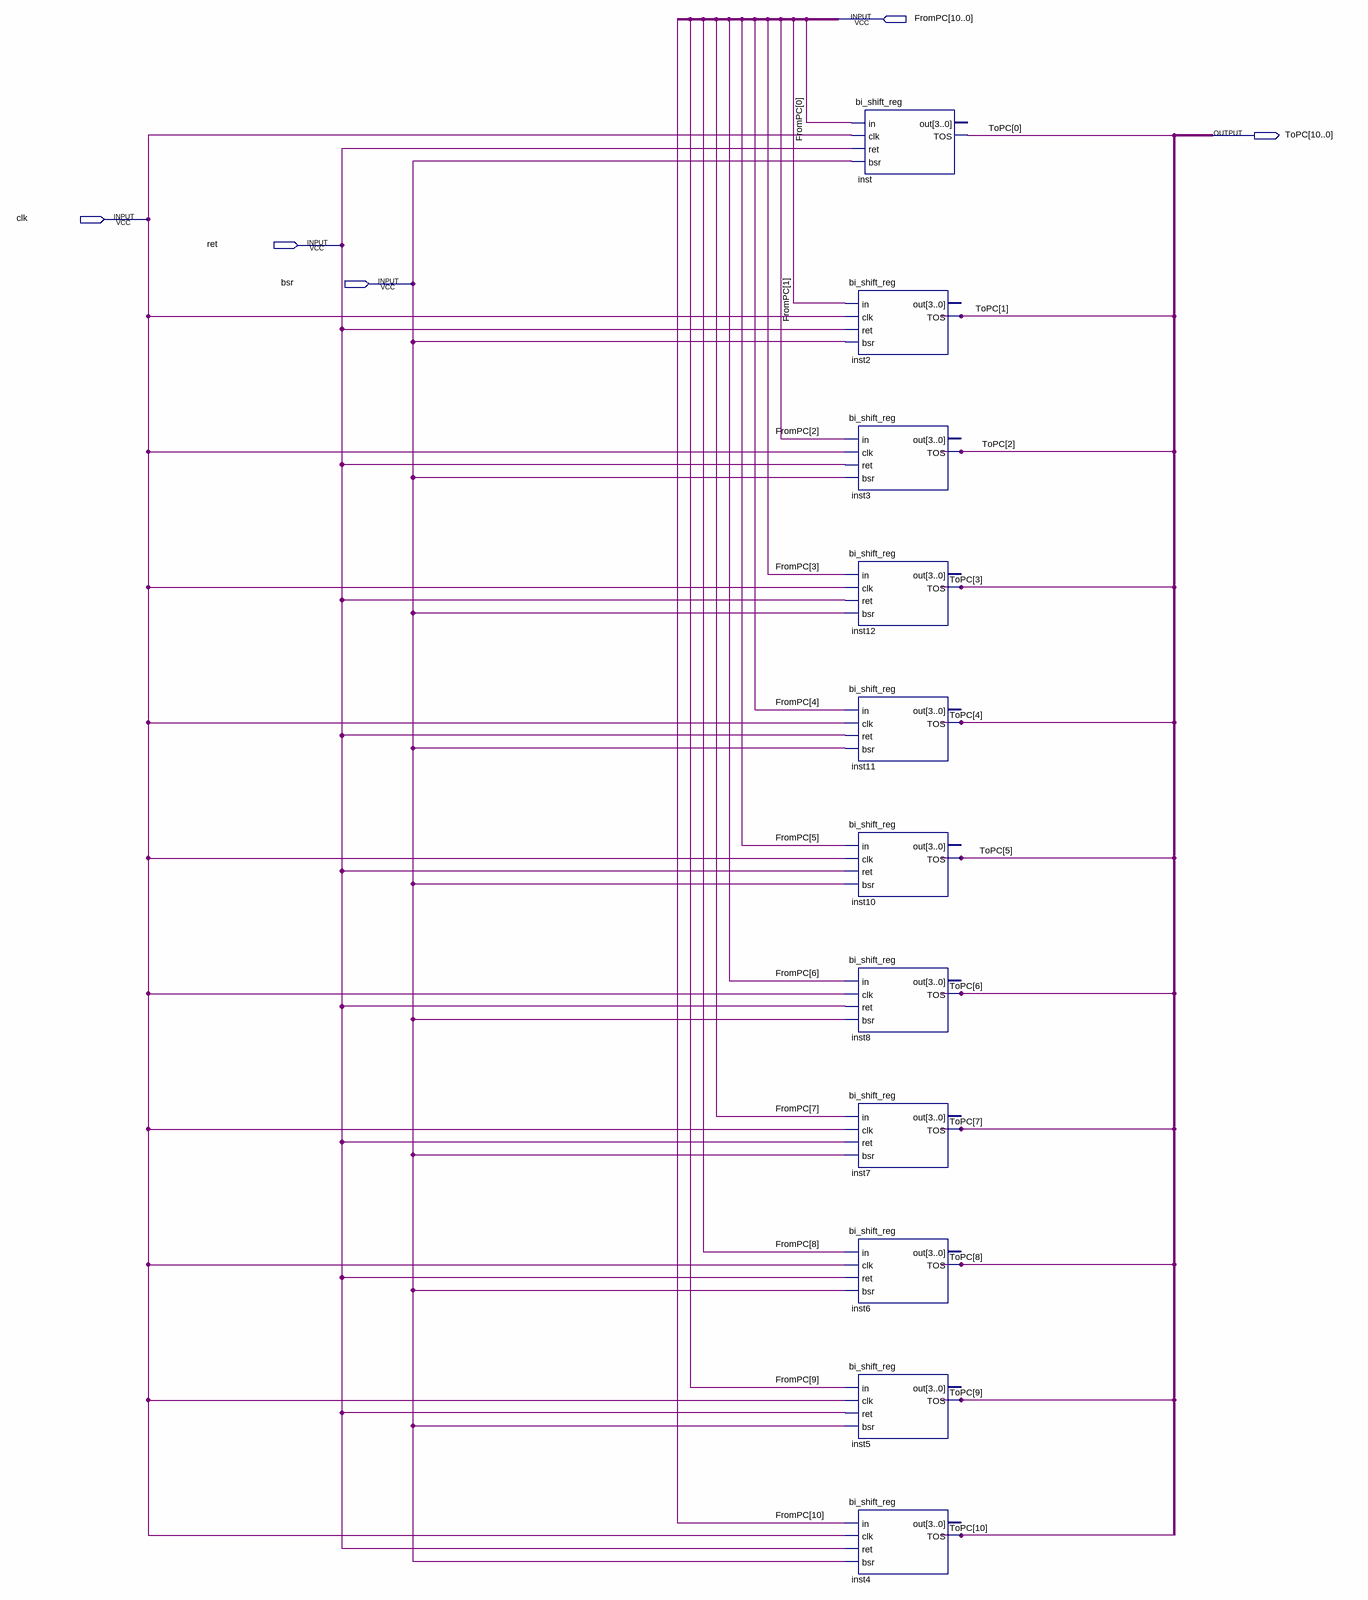
[diagram p0: schematic sheet]
// Quartus schematic stack.bdf as structural Verilog: 11 symbols, 5 pins
module stack (
  input  [10:0] FromPC,
  input  clk,
  input  ret,
  input  bsr,
  output [10:0] ToPC
);

  bi_shift_reg inst2 (.in(FromPC[1]), .clk(clk), .ret(ret), .bsr(bsr), .TOS(ToPC[1]));  // open: out
  bi_shift_reg inst3 (.in(FromPC[2]), .clk(clk), .ret(ret), .bsr(bsr), .TOS(ToPC[2]));  // open: out
  bi_shift_reg inst12 (.in(FromPC[3]), .clk(clk), .ret(ret), .bsr(bsr), .TOS(ToPC[3]));  // open: out
  bi_shift_reg inst11 (.in(FromPC[4]), .clk(clk), .ret(ret), .bsr(bsr), .TOS(ToPC[4]));  // open: out
  bi_shift_reg inst10 (.in(FromPC[5]), .clk(clk), .ret(ret), .bsr(bsr), .TOS(ToPC[5]));  // open: out
  bi_shift_reg inst8 (.in(FromPC[6]), .clk(clk), .ret(ret), .bsr(bsr), .TOS(ToPC[6]));  // open: out
  bi_shift_reg inst7 (.in(FromPC[7]), .clk(clk), .ret(ret), .bsr(bsr), .TOS(ToPC[7]));  // open: out
  bi_shift_reg inst6 (.in(FromPC[8]), .clk(clk), .ret(ret), .bsr(bsr), .TOS(ToPC[8]));  // open: out
  bi_shift_reg inst5 (.in(FromPC[9]), .clk(clk), .ret(ret), .bsr(bsr), .TOS(ToPC[9]));  // open: out
  bi_shift_reg inst4 (.in(FromPC[10]), .clk(clk), .ret(ret), .bsr(bsr), .TOS(ToPC[10]));  // open: out
  bi_shift_reg inst (.in(FromPC[0]), .clk(clk), .ret(ret), .bsr(bsr), .TOS(ToPC[0]));  // open: out
endmodule
